# EAGLE design poorDuino (EAGLE 7.3.0)
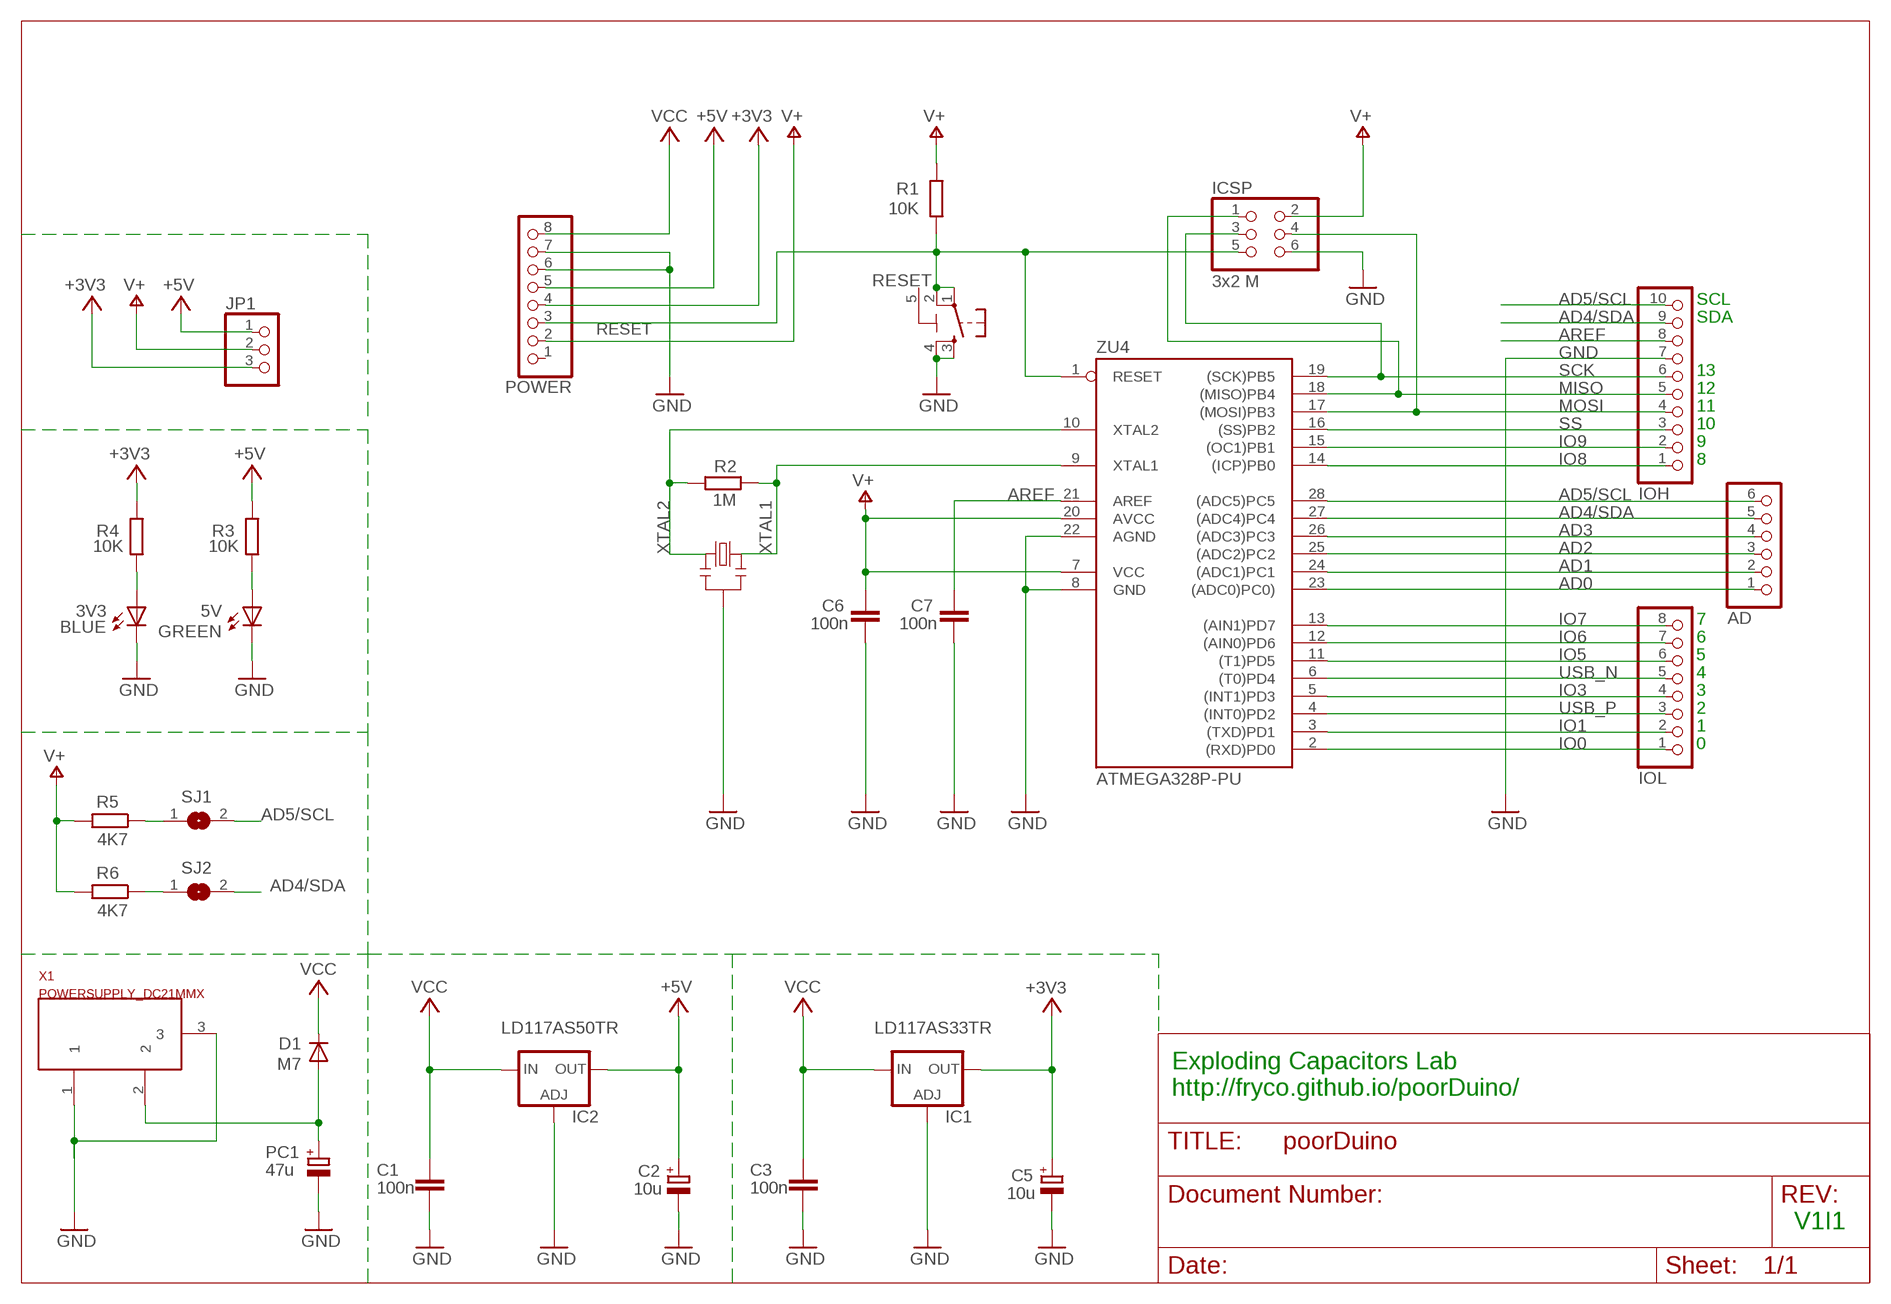
[diagram p0: schematic, sheet 1]

## Parts
3V3  BLUE  LEDCHIP-LED0805  [CHIP-LED0805]
5V  GREEN  LEDCHIP-LED0805  [CHIP-LED0805]
AD  6x1F-H8.5  PINHD-1X6  [1X06]
C1  100n  C-EUC0805  [C0805]
C2  10u  CPOL-EUSMCA  [SMC_A]
C3  100n  C-EUC0805  [C0805]
C5  10u  CPOL-EUSMCA  [SMC_A]
C6  100n  C-EUC0805  [C0805]
C7  100n  C-EUC0805  [C0805]
D1  M7  DIODE-SMB  [SMB]
IC1  LD117AS33TR  [SOT223]
IC2  LD117AS50TR  [SOT223]
ICSP  3x2 M  PINHD-2X3  [2X03]
IOH  10x1F-H8.5  PINHD-1X10_ARD  [1X10]
IOL  8x1F-H8.5  PINHD-1X8  [1X08]
JP1  PINHD-1X3  [1X03]
PC1  47u  CPOL-EUD  [PANASONIC_D]
POWER  8x1F-H8.5  PINHD-1X8  [1X08]
R1  10K  R-EU_R0805  [R0805]
R2  1M  R-EU_R0805  [R0805]
R3  10K  R-EU_R0805  [R0805]
R4  10K  R-EU_R0805  [R0805]
R5  4K7  R-EU_R0805  [R0805]
R6  4K7  R-EU_R0805  [R0805]
RESET  TS42031-160R-TR-7260  TS42  [TS42]
SJ1  SJ  [SJ]
SJ2  SJ  [SJ]
X1  POWERSUPPLY_DC21MMX  [POWERSUPPLY_DC-21MM]
Y2  CSTCE16M0V53-R0 16MHZ  RESONATORMU  [RESONATOR]
ZU4  ATMEGA328P-PU  [DIL28-3]

## Nets
+3V3: C5.+ IC1.4(OUT) JP1.3 POWER.4 R4.1
+5V [usbvcc]: C2.+ IC2.4(OUT) JP1.1 POWER.5 R3.1
AD0: AD.1 ZU4.23((ADC0)PC0))
AD1: AD.2 ZU4.24((ADC1)PC1)
AD2: AD.3 ZU4.25((ADC2)PC2)
AD3: AD.4 ZU4.26((ADC3)PC3)
AD4/SDA: AD.5 IOH.9 SJ2.2 ZU4.27((ADC4)PC4)
AD5/SCL: AD.6 IOH.10 SJ1.2 ZU4.28((ADC5)PC5)
AREF [aref]: C7.2 IOH.8 ZU4.21(AREF)
GND [gnd]: 3V3.C 5V.C C1.1 C2.- C3.1 C5.- C6.1 C7.1 IC1.1(ADJ) IC2.1(ADJ) ICSP.6 IOH.7 PC1.- POWER.6 POWER.7 RESET.3 RESET.4 X1.1 X1.3 Y2.2 ZU4.8(GND) ZU4.22(AGND)
IO0: IOL.1 ZU4.2((RXD)PD0)
IO1: IOL.2 ZU4.3((TXD)PD1)
IO3: IOL.4 ZU4.5((INT1)PD3)
IO5: IOL.6 ZU4.11((T1)PD5)
IO6: IOL.7 ZU4.12((AIN0)PD6)
IO7: IOL.8 ZU4.13((AIN1)PD7)
IO8: IOH.1 ZU4.14((ICP)PB0)
IO9: IOH.2 ZU4.15((OC1)PB1)
MISO: ICSP.1 IOH.5 ZU4.18((MISO)PB4)
MOSI: ICSP.4 IOH.4 ZU4.17((MOSI)PB3)
N$1: 3V3.A R4.2
N$3: 5V.A R3.2
N$6: R5.1 SJ1.1
N$7: R6.1 SJ2.1
PWRIN [power]: D1.A PC1.+ X1.2
RESET: ICSP.5 POWER.3 R1.1 RESET.1 RESET.2 ZU4.1(RESET)
SCK: ICSP.3 IOH.6 ZU4.19((SCK)PB5)
SS: IOH.3 ZU4.16((SS)PB2)
USB_N: IOL.5 ZU4.6((T0)PD4)
USB_P: IOL.3 ZU4.4((INT0)PD2)
V+: C6.2 ICSP.2 JP1.2 POWER.2 R1.2 R5.2 R6.2 ZU4.7(VCC) ZU4.20(AVCC)
VCC: C1.2 C3.2 D1.C IC1.3(IN) IC2.3(IN) POWER.8
XTAL1: R2.1 Y2.3 ZU4.9(XTAL1)
XTAL2: R2.2 Y2.1 ZU4.10(XTAL2)
Unconnected: POWER.1

## Notes on the sheet
- SCL
- SDA
- 13
- 12
- 11
- 10
- 9
- 8
- 7
- 6
- 5
- 4
- 3
- 2
- 1
- 0
- Exploding Capacitors Lab
  http://fryco.github.io/poorDuino/
- V1I1

## Power pins joined to a net without a drawn wire
5-GND: RESET.5(5-GND)

## Library data of the parts
3V3 5V = led:LED: LED OSRAM: - CHIPLED LG R971, LG N971, LY N971, LG Q971, LY Q971, LO R971, LY R971 LH N974, LH R974 LS Q976, LO Q976, LY Q976 LO Q996 - Hyper CHIPLED LW Q18S LB Q993, LB Q99A, LB R99A - SideLED LS A670, LO A670, LY A670, LG A670, LP A670 LB A673, LV A673, LT A673, LW A673 LH A674 LY A675 LS A676, LA A676, LO A676, LY A676, LW A676 LS A679, LY A679, LG A679 - Hyper Micro SIDELED® LS Y876, LA Y876, LO Y876, LY Y876 LT Y87S - SmartLED LW L88C, LW L88S LB L89C, LB L89S, LG L890 LS L89K, LO L89K, LY L89K LS L896, LA L896, LO L896, LY L896 - TOPLED LS T670, LO T670, LY T670, LG T670, LP T670 LSG T670, LSP T670, LSY T670, LOP T670, LYG T670 LG T671, LOG T671, LSG T671 LB T673, LV T673, LT T673, LW T673 LH T674 LS T676, LA T676, LO T676, LY T676, LB T676, LH T676, LSB T676, LW T676 LB T67C, LV T67C, LT T67C, LS T67K, LO T67K, LY T67K, LW E67C LS E67B, LA E67B, LO E67B, LY E67B, LB E67C, LV E67C, LT E67C LW T67C LS T679, LY T679, LG T679 LS T770, LO T770, LY T770, LG T770, LP T770 LB T773, LV T773, LT T773, LW T773 LH T774 LS E675, LA E675, LY E675, LS T675 LS T776, LA T776, LO T776, LY T776, LB T776 LHGB T686 LT T68C, LB T68C - Hyper Mini TOPLED® LB M676 - Mini TOPLED Santana® LG M470 LS M47K, LO M47K, LY M47K Source: http://www.osram.convergy.de LUXEON: - LUMILED® LXK2-PW12-R00, LXK2-PW12-S00, LXK2-PW14-U00, LXK2-PW14-V00 LXK2-PM12-R00, LXK2-PM12-S00, LXK2-PM14-U00 LXK2-PE12-Q00, LXK2-PE12-R00, LXK2-PE12-S00, LXK2-PE14-T00, LXK2-PE14-U00 LXK2-PB12-K00, LXK2-PB12-L00, LXK2-PB12-M00, LXK2-PB14-N00, LXK2-PB14-P00, LXK2-PB14-Q00 LXK2-PR12-L00, LXK2-PR12-M00, LXK2-PR14-Q00, LXK2-PR14-R00 LXK2-PD12-Q00, LXK2-PD12-R00, LXK2-PD12-S00 LXK2-PH12-R00, LXK2-PH12-S00 LXK2-PL12-P00, LXK2-PL12-Q00, LXK2-PL12-R00 Source: www.luxeon.com KINGBRIGHT: KA-3528ASYC Source: www.kingbright.com
AD = SmartPrj:PINHD-1X6: PIN HEADER
C1 C3 C6 C7 = SmartPrj:C-EU: CAPACITOR, European symbol
C2 C5 PC1 = rcl:CPOL-EU: POLARIZED CAPACITOR, European symbol
D1 = diode:DIODE-: DIODE
IC1 IC2 = v-reg:LD117A?*: Low drop fixed and adjustable positive voltage regulators 1 A Source: http://www.st.com/stonline/products/literature/ds/7194/ld1117axx.pdf
ICSP = SmartPrj:PINHD-2X3: PIN HEADER
IOH = SmartPrj:PINHD-1X10_ARD: PIN HEADER
IOL POWER = SmartPrj:PINHD-1X8: PIN HEADER
JP1 = pinhead:PINHD-1X3: PIN HEADER
R1-R6 = SmartPrj:R-EU_: RESISTOR, European symbol
RESET = SmartPrj:TS42: TS42 Dongnan Electronics Tact switch VDC 12V - 50mA
SJ1 SJ2 = jumper:SJ: SMD solder JUMPER
X1 = SmartPrj:POWERSUPPLY_DC21MM
Y2 = SmartPrj:RESONATOR
ZU4 = SmartPrj:ATMEGA328P-: MICROCONTROLLER 4 Kbytes FLASH 128 bytes SRAM 256 bytes EEPROM UART 6-channel 10 bit ADC

## Net classes
0 default: width 0.254 mm, clearance 0.254 mm
1 power: width 0.61 mm, drill 0.61 mm, clearance 0.254 mm
2 gnd: width 0.305 mm, drill 0.559 mm, clearance 0.254 mm
3 usbvcc: width 0.508 mm, drill 0.61 mm, clearance 0.254 mm
4 aref: width 0.406 mm, drill 0.61 mm, clearance 0.254 mm

## Board
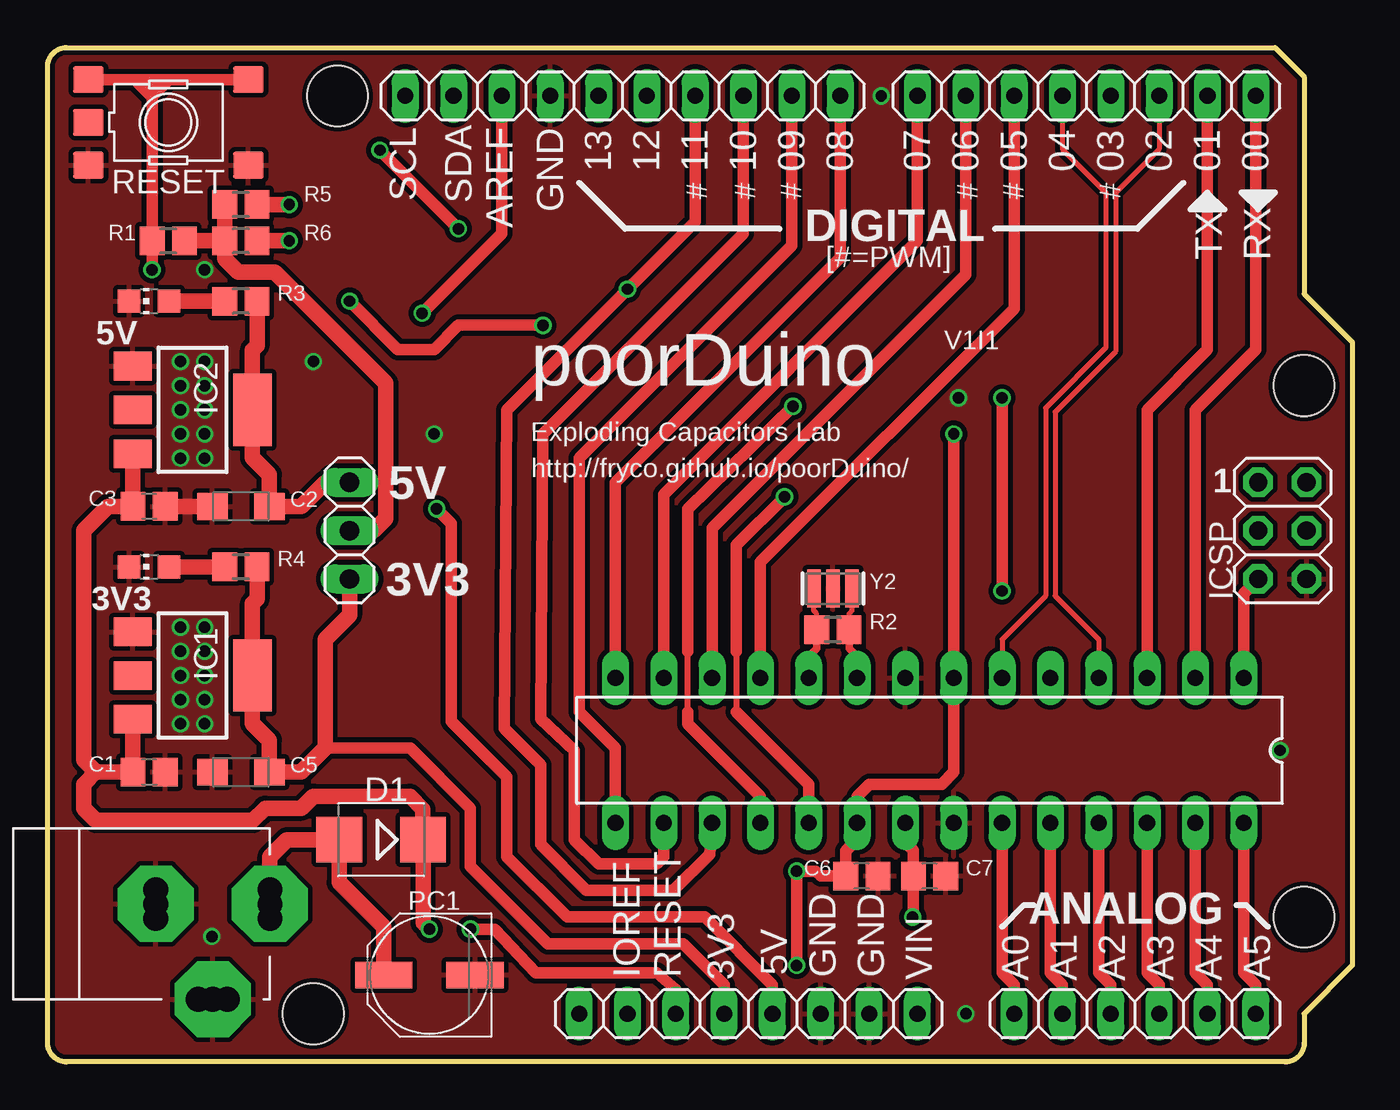
[diagram p1: board, top side]
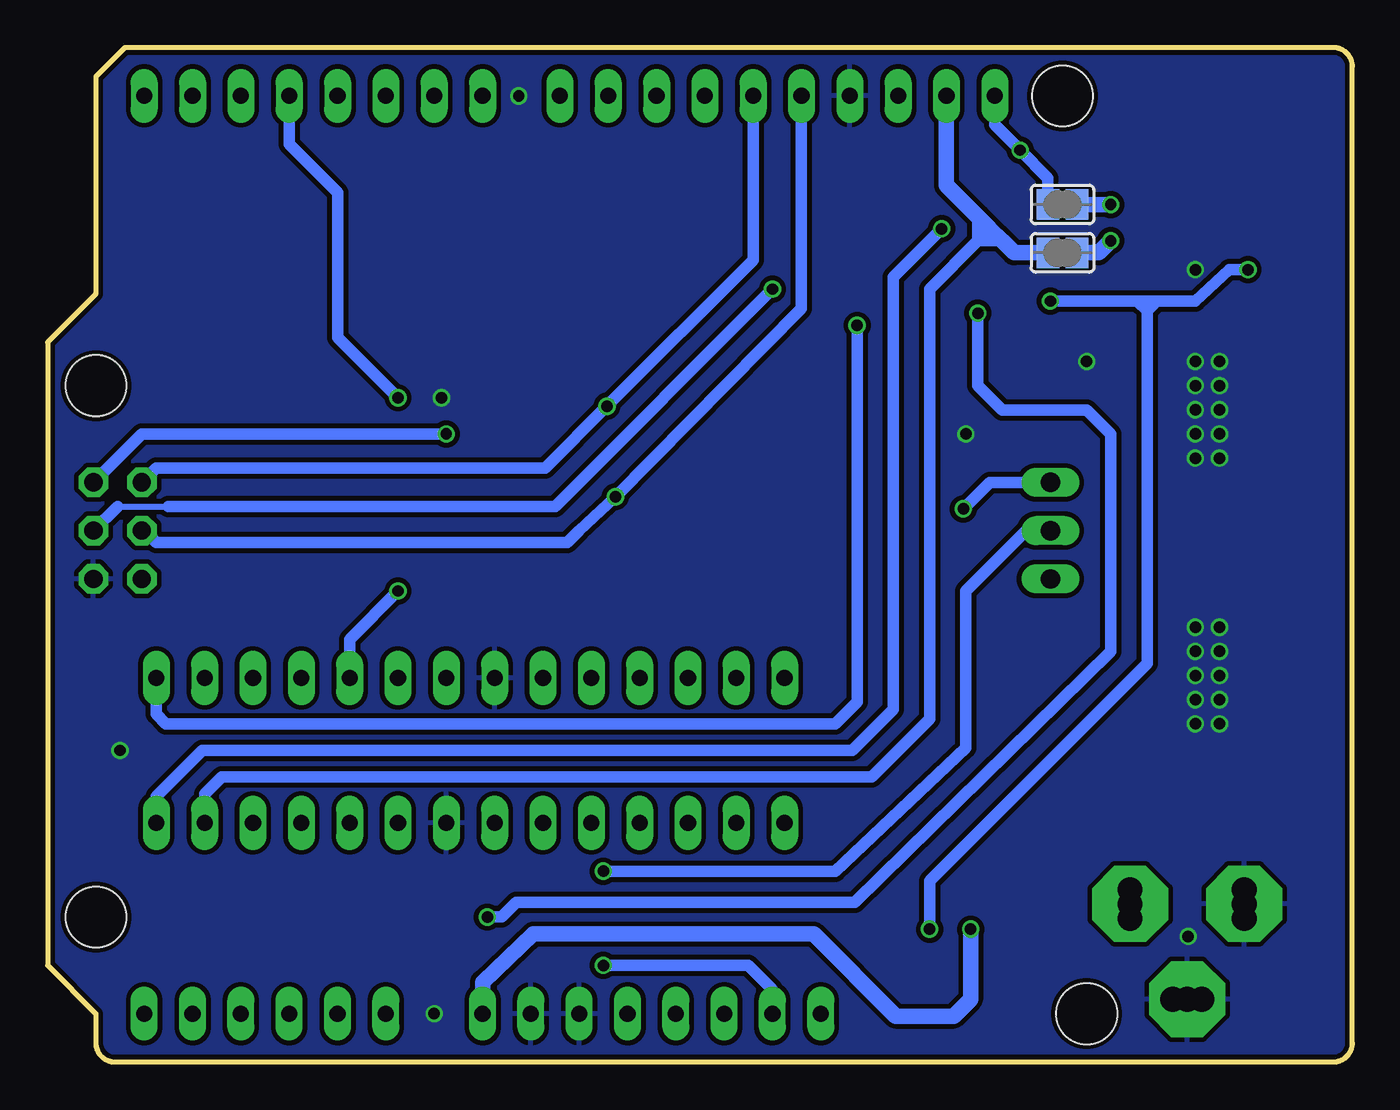
[diagram p2: board, bottom side, seen from below]

Size 68.58 x 53.34 mm. Coordinates in mm from the lower left corner, seen from the top.
Outline: 64.52,53.34 66.04,51.82 66.04,40.39 68.58,37.85 68.58,5.08 66.04,2.54 66.04,1 arc-90 65.04,0 1,0 arc-90 0,1 0,52.34 arc-90 1,53.34 64.52,53.34
Copper layers (1*16): Top 0.035mm / dielectric 1.5mm / Bottom 0.035mm
Design rules "dirt_cheap_dirty_boards.v1": minimum track width 5mil, minimum drill 12mil, track to track 5mil, track to pad 5mil, pad to pad 5mil, via to via 5mil, smd to smd 0mil, copper to edge 10mil, drill to drill 10mil, minimum pad ring 10mil, minimum via ring 6mil, stop-mask expansion 2mil, vias tented up to drill 25mil, thermal gap 10mil
Holes 3.2 mm at 66.04,35.56 66.04,7.62 15.24,50.8 13.97,2.54
vRestrict: area 22.9,44.1 to 24.6,49.1; area 25.4,45.5 to 27.1,49.1; area 28.4,45.3 to 29.6,48.8; area 31,45.3 to 32.1,48.8; area 33.5,45.3 to 34.7,48.8; area 36.1,45.3 to 37.2,48.8; area 38.7,47.2 to 39.9,48.8; area 40.3,45.1 to 47.6,46.9; area 60.3,44.2 to 61.7,46.7; area 62.9,44.2 to 64.3,46.7; area 61.3,35.8 to 64.8,37.2; area 0.6,21.8 to 2,30.1; 14 more areas

### Footprints (pad centres in the part's own frame; a part is rotated, then mirrored left to right if it is on the bottom)
CHIP-LED0805 = smd 1.2 x 1.2: A 0,-1.05; C 0,1.05
1X06 = drill 0.85 pad 1.422 long: 1 -6.35,0; 2 -3.81,0; 3 -1.27,0; 4 1.27,0; 5 3.81,0; 6 6.35,0
C0805 = smd 1.3 x 1.5: 1 -0.85,0; 2 0.85,0
SMC_A = smd 1.6 x 1.4: + -1.5,0; - 1.5,0
SMB = smd 2.4 x 2.4: A 2.2,0; C -2.2,0
SOT223 = smd 1.5 x 2: 1 -2.3,-3.15; 2 0,-3.15; 3 2.3,-3.15 | smd 3.8 x 2: 4 0,3.15
2X03 = drill 0.95 pad 1.55 octagon: 1 -2.54,-1.27; 2 -2.54,1.27; 3 0,-1.27; 4 0,1.27; 5 2.54,-1.27; 6 2.54,1.27
1X10 = drill 0.85 pad 1.422 long: 1 -11.43,0; 2 -8.89,0; 3 -6.35,0; 4 -3.81,0; 5 -1.27,0; 6 1.27,0; 7 3.81,0; 8 6.35,0; 9 8.89,0; 10 11.43,0
1X08 = drill 0.85 pad 1.422 long: 1 -8.89,0; 2 -6.35,0; 3 -3.81,0; 4 -1.27,0; 5 1.27,0; 6 3.81,0; 7 6.35,0; 8 8.89,0
1X03 = drill 1.016 long: 1 -2.54,0; 2 0,0; 3 2.54,0
PANASONIC_D = smd 3 x 1.4: + 2.4,0; - -2.4,0
R0805 = smd 1.3 x 1.5: 1 -0.85,0; 2 0.85,0
TS42 = smd 1.6 x 1.4: 1 -4.2,2.25; 2 4.2,2.25; 3 -4.2,-2.25; 4 4.2,-2.25; 5 -4.2,0
SJ = smd 1.168 x 1.6: 1 -0.762,0; 2 0.762,0
POWERSUPPLY_DC-21MM = drill 1.3 pad 4 octagon: 1 -5.08,-3.353; 2 -0.076,-6.35; 3 -0.076,-0.356 | drill 1.3: 4 -5.08,-4.115; 5 -5.08,-2.591; 6 -0.838,-0.356; 7 0.686,-0.356; 8 -0.838,-6.35; 9 0.686,-6.35
RESONATOR = smd 0.7 x 2: 1 -1,0; 2 0,0; 3 1,0
DIL28-3 = drill 0.85 pad 1.422 long: 1 -16.51,-3.81; 2 -13.97,-3.81; 3 -11.43,-3.81; 4 -8.89,-3.81; 5 -6.35,-3.81; 6 -3.81,-3.81; 7 -1.27,-3.81; 8 1.27,-3.81; 9 3.81,-3.81; 10 6.35,-3.81; 11 8.89,-3.81; 12 11.43,-3.81; 13 13.97,-3.81; 14 16.51,-3.81; 15 16.51,3.81; 16 13.97,3.81; 17 11.43,3.81; 18 8.89,3.81; 19 6.35,3.81; 20 3.81,3.81; 21 1.27,3.81; 22 -1.27,3.81; 23 -3.81,3.81; 24 -6.35,3.81; 25 -8.89,3.81; 26 -11.43,3.81; 27 -13.97,3.81; 28 -16.51,3.81

### Placement (x,y rotation side)
3V3  5.33,26.04 90 top
5V  5.33,40.01 90 top
AD  57.15,2.54 0 top
C1  5.33,15.24 180 top
C2  10.16,29.21 180 top
C3  5.33,29.21 180 top
C5  10.16,15.24 180 top
C6  42.8,9.78 180 top
C7  46.35,9.78 180 top
D1  17.53,11.68 180 top
IC1  7.62,20.32 270 top
IC2  7.62,34.29 270 top
ICSP  64.9,27.94 270 top
IOH  30.23,50.8 180 top
IOL  54.61,50.8 180 top
JP1  15.88,27.94 270 top
PC1  20.07,4.57 180 top
POWER  36.83,2.54 0 top
R1  6.35,43.18 0 top
R2  41.27,22.73 180 top
R3  10.16,40.01 180 top
R4  10.16,26.04 180 top
R5  10.16,45.09 180 top
R6  10.16,43.18 180 top
RESET  6.35,49.4 0 top
SJ1  15.24,45.09 180 bottom
SJ2  15.24,42.55 180 bottom
X1  5.33,8.38 90 top
Y2  41.27,24.89 0 top
ZU4  46.35,16.38 180 top

### Tracks (layer width: path | path; a pad name or v marks a point on that pad's centre or on a via)
+3V3
  Top 0.61: 14.61,16.51 19.05,16.51 22.23,13.34 22.23,10.29 26.29,6.22 33.4,6.22 35.56,4.06 POWER.4
  Top 0.813: R4.1 11.01,24.34 10.77,24.11 IC1.4 10.77,17.8 11.66,16.91 C5.+ 13.34,15.24 14.61,16.51 14.61,22.23 15.88,23.5 JP1.3
+5V  (via drill 0.6)
  Top 0.61: POWER.5 38.1,4.06 34.54,7.62 27.3,7.62 24.13,10.79 24.13,14.99 21.21,17.91 21.21,28.32 v20.45,29.08
  Top 0.813: R3.1 11.01,37.68 10.77,37.44 IC2.4 10.77,31.77 11.66,30.89 C2.+ 13.34,29.21 14.61,30.48 JP1.1
  Bottom 0.61: JP1.1 19.05,30.48 v20.45,29.08
AD0
  Top 0.61: ZU4.23 50.16,4.7 50.8,4.06 AD.1
AD1
  Top 0.61: ZU4.24 52.7,4.7 53.34,4.06 AD.2
AD2
  Top 0.61: ZU4.25 55.24,4.7 55.88,4.06 AD.3
AD3
  Top 0.61: ZU4.26 57.78,4.7 58.42,4.06 AD.4
AD4/SDA
  Top 0.406: ZU4.27 60.33,12.7
  Top 0.61: AD.5 60.96,4.06 60.33,4.7 ZU4.27
  Bottom 0.61: ZU4.27 60.33,14.1 59.44,14.99 25.27,14.99 22.23,18.03 22.23,40.64 19.68,43.18 | 19.68,43.18 19.05,43.81 | 19.68,43.18 19.68,44.45 | 19.68,43.18 18.41,43.18
  Bottom 0.813: SJ2.2 17.78,42.55 18.41,43.18 19.05,43.81 19.68,44.45 21.34,46.1 IOH.9
AD5/SCL  (via drill 0.6)
  Top 0.61: ZU4.28 62.87,4.7 63.5,4.06 AD.6 | v21.59,43.81 v17.46,47.94
  Bottom 0.61: ZU4.28 62.87,13.97 60.45,16.38 26.29,16.38 24.13,18.54 24.13,41.27 v21.59,43.81 | SJ1.2 16,46.48 v17.46,47.94 17.78,48.26 18.8,49.28 IOH.10
AREF  (via drill 0.6)
  Top 0.61: ZU4.21 45.09,11.56 45.51,11.14 C7.2 45.51,7.83 v45.47,7.62 | IOH.8 23.88,43.56 v19.68,39.37
  Bottom 0.61: v19.68,39.37 19.68,35.56 18.41,34.29 13.97,34.29 12.7,33.02 12.7,21.59 26.16,8.38 43.94,8.38 44.7,7.62 v45.47,7.62
GND  (via drill 0.6)
  Top 0.813: C3.1 C2.-
  other vias: 6.99,22.86 6.99,21.59 6.99,20.32 6.99,19.05 6.99,17.78 8.26,22.86 8.26,21.59 8.26,20.32 8.26,19.05 8.26,17.78 6.99,36.83 8.26,36.83 6.99,35.56 6.99,34.29 6.99,33.02 6.99,31.75 8.26,31.75 8.26,33.02 8.26,34.29 8.26,35.56 13.97,36.83 48.26,2.54 43.81,50.8 64.77,16.38 8.64,6.6 20.32,33.02 47.88,34.92 8.26,41.66
  pour Bottom (isolate 0.254): 0,53.34 0,0 68.58,0 68.58,53.34
  pour Top (isolate 0.254): 0,53.34 0,0 68.58,0 68.58,53.34
IO0
  Top 0.61: ZU4.2 60.33,34.29 63.5,37.47 IOL.1
IO1
  Top 0.61: ZU4.3 57.78,34.29 60.96,37.47 IOL.2
IO3  (via drill 0.6)
  Top 0.61: v50.16,24.77 v50.16,34.92
  Bottom 0.61: ZU4.5 52.7,22.23 v50.16,24.77 | v50.16,34.92 53.34,38.1 53.34,45.72 55.88,48.26 IOL.4
IO5
  Top 0.61: IOL.6 50.8,39.62 37.47,26.29 ZU4.11
IO6
  Top 0.61: ZU4.12 34.92,28.07 48.26,41.4 IOL.7
IO7
  Top 0.61: ZU4.13 32.38,29.84 45.72,43.18 IOL.8
IO8
  Top 0.61: ZU4.14 29.84,30.48 41.66,42.29 IOH.1
IO9
  Top 0.61: ZU4.15 29.84,16.51 27.94,18.41 27.94,31.75 39.12,42.93 IOH.2
MISO  (via drill 0.6)
  Top 0.305: 33.66,18.41 33.66,21.59
  Top 0.61: ZU4.18 37.47,13.97 33.66,17.78 33.66,18.41 | 33.66,21.59 33.66,29.08 v39.18,34.48
  Bottom 0.61: IOH.5 31.5,42.16 v39.18,34.48 42.42,31.24 62.87,31.24 ICSP.1
MOSI  (via drill 0.6)
  Top 0.61: ZU4.17 34.8,10.92 32.89,9.02 28.32,9.02 25.91,11.43 25.91,15.62 24,17.53 24.13,34.29 v30.48,40.64 34.04,44.2 IOH.4
  Bottom 0.305: 64.9,29.21 62.23,29.21
  Bottom 0.61: ICSP.4 64.9,29.21 | 62.23,29.21 41.91,29.21 v30.48,40.64
N$1
  Top 0.813: 3V3.A R4.2
N$2
  Top 0.61: 5.54,50.8 6.35,51.61
N$3
  Top 0.813: 5V.A R3.2
N$4
  Top 0.61: 5.44,50.8 4.78,51.46
N$6  (via drill 0.6)
  Top 0.813: R5.1 v12.7,45.09
  Bottom 0.813: v12.7,45.09 SJ1.1
N$7  (via drill 0.6)
  Top 0.813: R6.1 v12.7,43.18
  Bottom 0.813: SJ2.1 13.34,42.55 v12.7,43.18
PWRIN
  Top 0.813: X1.2 11.68,10.79 12.57,11.68 D1.A 15.33,9.44 17.67,7.1 PC1.+
RESET  (via drill 0.6)
  Top 0.61: ZU4.1 62.87,24.64 ICSP.5 | v15.88,40.01 18.41,37.47 20.32,37.47 21.59,38.73 v26.04,38.73 | POWER.3 33.02,3.81 32,4.7 25.65,4.7 23.5,6.99 v22.23,6.99 | v5.49,41.66 5.5,41.74 R1.1 5.5,51.44 5.71,51.65 | RESET.2 5.71,51.65 | 5.71,51.65 RESET.1
  Bottom 0.61: v26.04,38.73 26.04,18.92 27.18,17.78 62.36,17.78 62.87,18.29 ZU4.1 | v15.88,40.01 11.3,40.01 | 11.3,40.01 10.79,40.01 | 10.79,40.01 8.26,40.01 6.48,41.66 v5.49,41.66 | 10.79,39.5 10.79,20.95 22.23,9.53 v22.23,6.99 | 10.79,39.5 10.79,40.01 | 10.79,39.5 11.3,40.01 | 10.79,39.5 10.41,39.88
SCK  (via drill 0.6)
  Top 0.305: 36.2,21.59 36.2,18.41
  Top 0.61: 36.2,21.59 36.2,27.18 v38.73,29.72 | ZU4.19 40.01,14.61 36.2,18.41
  Bottom 0.61: IOH.6 28.96,39.62 v38.73,29.72 40.64,27.94 41.27,27.3 62.87,27.3 63.5,27.94 ICSP.3
SS
  Top 0.61: ZU4.16 32.38,10.79 32,10.41 28.96,10.41 27.69,11.68 27.69,16.38 25.91,18.03 26.04,33.02 36.58,43.56 IOH.3
USB_N
  Top 0.254: IOL.5 53.34,48.01 55.63,45.72 55.63,37.57 52.45,34.4 52.45,24.51 50.16,22.23 ZU4.6
USB_P
  Top 0.254: IOL.3 58.42,48.01 56.13,45.72 56.13,37.36 52.96,34.19 52.96,24.51 55.24,22.23 ZU4.4
V+  (via drill 0.6)
  Top 0.61: v47.62,33.02 ZU4.7 47.62,15.24 46.99,14.61 43.18,14.61 42.55,13.97 ZU4.20 42.55,11.68 41.95,11.09 C6.2 40.64,9.78 40.39,10.03 v39.37,10.03 v39.37,5.08
  Top 0.813: R5.2 R6.2 | R6.2 9.31,42.25 10.03,41.53 11.94,41.53 17.78,35.69 17.78,28.57 17.14,27.94 JP1.2 | R1.2 R6.2
  Bottom 0.61: JP1.2 17.14,27.94 20.32,24.77 20.32,16.51 27.18,10.03 v39.37,10.03 | POWER.2 30.48,3.81 31.75,5.08 v39.37,5.08 | v47.62,33.02 63.63,33.02 ICSP.2
VCC  (via drill 0.6)
  Top 0.813: 19.98,11.43 D1.C | IC1.3 4.48,18.01 C1.2 2.54,15.24 | IC2.3 4.48,31.98 C3.2 3.17,29.21 1.91,27.94 1.91,15.88 2.54,15.24 | 2.54,15.24 1.91,14.61 1.91,13.34 2.54,12.7 10.79,12.7 11.43,13.34 13.34,13.34 13.97,13.97 19.05,13.97 19.73,13.29 D1.C | D1.C 19.74,7.32 v20.07,6.99
  Bottom 0.813: v20.07,6.99 20.07,3.3 20.95,2.41 24,2.41 28.32,6.73 43.05,6.73 45.72,4.19 POWER.8
XTAL1
  Top 0.254: R2.1 42.12,23.58 42.27,23.73 Y2.3
  Top 0.406: ZU4.9 42.55,21.34 42.12,21.76 R2.1
XTAL2
  Top 0.254: R2.2 40.42,23.58 40.26,23.75 40.26,24.88 Y2.1
  Top 0.406: ZU4.10 40.01,21.34 40.42,21.76 R2.2

### Text on the board
tPlace: 13 | 12 | 11 | 10 | 09 | 08 | 07 | 06 | 05 | 04 | 03 | 02 | 01 | 00
tNames: SCL | SDA | AREF | GND | # | # | # | # | # | # | DIGITAL | [#=PWM] | TX | RX | V1I1 | poorDuino | Exploding Capacitors Lab | http://fryco.github.io/poorDuino/ | 5V | 1 | 3V3 | ANALOG | 5V | IOREF | RESET | 3V3 | GND | GND | VIN | A0 | A1 | A2 | A3 | A4 | A5
ReferenceLC: L | TX | ON | RX | PC1 | PC2
214bmp: D:/SmartProjects/Snc/a4_bn_logo2.bmp